# Altium schematic sheet 02-Power.SchDoc: ECE315 Analog
size A; Date: 4/25/2017; ApprovedBy: JSK; CheckedBy: JSK; Author: JSK; CompanyName: University of Wisconsin; DrawnBy: JSK; Engineer: JSK; Organization: ECE 315; Address1: College of Engineering; Address2: 1415 Engineering Drive; Address3: Madison, WI 53706; Address4: ECE 315 Fall 2017; Revision: A; SheetNumber: 2; SheetTotal: 2; AssemblyNumber: 0; MachineName: ECE315-S19; PCBNumber: 001; ApprovedDate: 1/17/2019
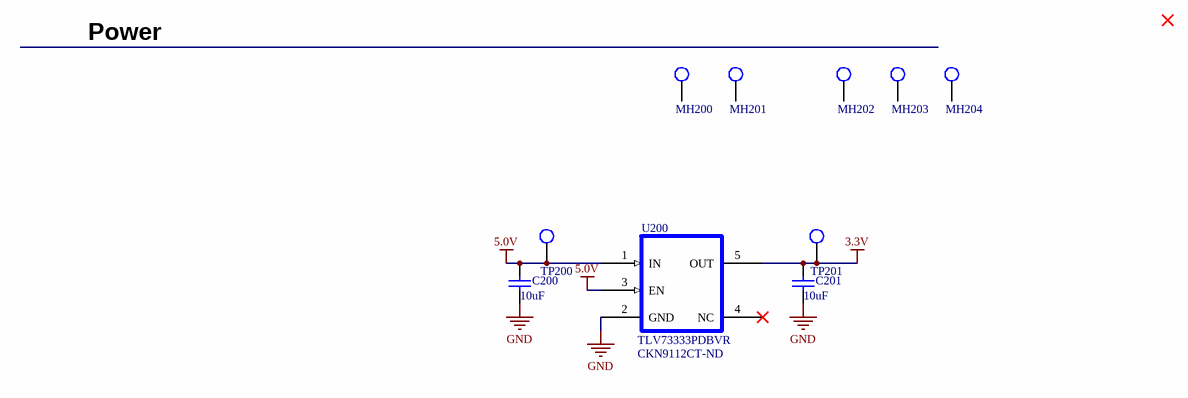
[diagram p0: 02-Power.SchDoc]

## Parts
C200  10uF  [CAP_0805]
C201  10uF  [CAP_0805]
MH200  MHOLE_2_55MM  [MHOLE_2_55MM]  (value not drawn)
MH201  MHOLE_2_55MM  [MHOLE_2_55MM]  (value not drawn)
MH202  MHOLE_2_55MM  [MHOLE_2_55MM]  (value not drawn)
MH203  MHOLE_2_55MM  [MHOLE_2_55MM]  (value not drawn)
MH204  MHOLE_2_55MM  [MHOLE_2_55MM]  (value not drawn)
TP200  TP_1206  [TP-SMC-1206]  (value not drawn)
TP201  TP_1206  [TP-SMC-1206]  (value not drawn)
U200  TLV73333PDBVR  Supplier Part Number 1: CKN9112CT-ND  [IC_TLV73333PDBVR]

## Nets
3.3V: C201.1 TP201.1 U200.5(OUT)
5.0V: C200.1 TP200.1 U200.1(IN) U200.3(EN)
GND: C200.2 C201.2 U200.2(GND)

Not connected (* = marked no-connect by the designer): MH200 1; MH201 1; MH202 1; MH203 1; MH204 1; U200 4(NC)*

## Notes on the sheet
- Power
- Title:
- Size:
- A
- Machine:
- P.C. Board No:
- Assembly No:
- Rev:
- Sheet:
- of
- College of Engineering
- 1415 Engineering Drive
- Madison, WI 53706

## Library data of the parts
C200 C201 = CAP_0805_U_010.00: CAP CER 10UF 16V X5R 0805; Manufacturer: Samsung; Manufacturer Part Number: CL21A106KOFNNNE; Tolerance: 10%; ComponentLink3URL: https://datasheet.ciiva.com/26920/getdatasheetpartid-355170-26920201.pdf; ComponentLink3Description: https://datasheet.ciiva.com/26920/getdatasheetpartid-355170-26920201.pdf; ComponentLink1URL: https://datasheet.ciiva.com/25730/cl21a106kpclqnc-25730594.pdf; ComponentLink1Description: https://datasheet.ciiva.com/25730/cl21a106kpclqnc-25730594.pdf; Mount: Surface Mount; Case/Package: 0805; Case Code (Metric): 2012; Case Code (Imperial): 0805; Min Operating Temperature: -55°C; Max Operating Temperature: 85°C; Packaging: Tape and Reel; Capacitance: 10uF; Voltage Rating: 16V; Package Quantity: 2000; Dielectric: X5R; Length: 2mm; Height: 1.25mm; Width: 0.049inch; Thickness: 0.053inch; Depth: 1.25mm; Radiation Hardening: No; ComponentLink2URL: http://www.samsungsem.com/kr/support/product-search/mlcc/CL21A106KOFNNNE.jsp; ComponentLink2Description: http://www.samsungsem.com/kr/support/product-search/mlcc/CL21A106KOFNNNE.jsp; ComponentLink4URL: http://www1.futureelectronics.com/doc/SAMSUNG/CL21A106KOFNNNE.pdf; ComponentLink4Description: http://www1.futureelectronics.com/doc/SAMSUNG/CL21A106KOFNNNE.pdf; ComponentLink5URL: https://www.verical.com/server-webapp/html/getDatasheet?partID=354009; ComponentLink5Description: https://www.verical.com/server-webapp/html/getDatasheet?partID=354009; Supplier 1: Digi-Key; Stock 1: 1158169; Pricing 1: 1=0.29, 10=0.199, 100=0.1009, 500=0.06904, 1000=0.06107 (USD)
MH200-MH204 = MHOLE_2_55MM: Mounting Holde; Manufacturer Part Number: UW MTHOLE
TP200 TP201 = TP_1206: Test Point SMD 1206; Manufacturer: TE Connectivity (Tyco Electronics); Manufacturer Part Number: 1625854-1; Resistance Value: 0 Ohm; Temperature Coefficient: N/R; Supplier 1: Digi-Key; Supplier Part Number 1: A106143CT-ND; Stock 1: 31937; Pricing 1: 1=0.28, 10=0.261, 25=0.224, 50=0.1902, 100=0.1828, 250=0.1641, 500=0.1567, 1000=0.1306 (USD); Case Size: 1206; Dimension: 3.2 x 1.6 x 1.25mm; Family: RC; Mounting: Surface Mount; Operating Temperature: -55 to 125 C; Part No: 1625854-1; RoHS: Yes; Packaging: Tape and Reel; Termination Style: N/R; Terminal Pitch: N/R; Power Rating: N/R; Tolerance: N/R; ComponentLink1URL: https://datasheet.ciiva.com/6439/eng-ds-1773266-a-6439169.pdf; ComponentLink1Description: https://datasheet.ciiva.com/6439/eng-ds-1773266-a-6439169.pdf; ComponentLink2URL: https://datasheet.ciiva.com/30136/1773266-a-30136341.pdf; ComponentLink2Description: https://datasheet.ciiva.com/30136/1773266-a-30136341.pdf; ComponentLink3URL: https://datasheet.ciiva.com/6439/eng-ds-1773266-a-6439080.pdf; ComponentLink3Description: https://datasheet.ciiva.com/6439/eng-ds-1773266-a-6439080.pdf; ComponentLink4URL: https://datasheet.ciiva.com/6439/eng-ds-1773266-a-6439081.pdf; ComponentLink4Description: https://datasheet.ciiva.com/6439/eng-ds-1773266-a-6439081.pdf; ComponentLink5URL: https://datasheet.ciiva.com/6439/eng-ds-1773266-a-6439083.pdf; ComponentLink5Description: https://datasheet.ciiva.com/6439/eng-ds-1773266-a-6439083.pdf
U200 = TLV73333PDBVR: Manufacturer: Texas Instruments; Number of Outputs: 1; Min Input Voltage: 1.4V; Max Input Voltage: 5.5V; Max Output Current: 300mA; Output Voltage: 3.3V; Dropout Voltage: 125mV; Min Current Limit: 360mA; Polarity: Positive; Quiescent Current: 60uA; Accuracy: 1%; Output Type: Fixed; Mechanical Life: 100000Cycles; Actuator Material: Nylon,Polyamide; Throw Configuration: SPST; Operating Force: 160gf; Illumination Type: Illuminated,Non-Illuminated; Switch Function: Off-Mom; Voltage Rating (DC): 12V; Actuator Type: Standard; Current Rating: 50mA; Contact Resistance: 100mR; Actuator Length: 0.85mm; Manufacturer Part Number: TLV73333PDBVR; Mount: Surface Mount; Case/Package: SOT-23-5; Number of Pins: 5; Weight: 0.000557oz; Contact Plating: Gold; Min Operating Temperature: -40°C; Max Operating Temperature: 125°C; Packaging: Tape and Reel; Output Current: 300mA; Number of Regulators: 1; Package Quantity: 3000; Radiation Hardening: No; Lead Free: Lead Free; ComponentLink1URL: http://www.ti.com/general/docs/lit/getliterature.tsp?genericPartNumber=TLV733P&&fileType=pdf; ComponentLink1Description: http://www.ti.com/general/docs/lit/getliterature.tsp?genericPartNumber=TLV733P&&fileType=pdf; Supplier 1: Digi-Key; Stock 1: 783192; Pricing 1: 1=0.16, 10=0.157, 25=0.1516, 50=0.1462, 100=0.1381, 250=0.12996, 500=0.12452 (USD); Contact Material: Silver; Color: Black; Termination: Gull Wing; Max Voltage Rating (DC): 12V; Orientation: Straight; Max Current Rating: 50mA; Length: 6mm; Depth: 9mm; REACH SVHC: No SVHC; ComponentLink2URL: https://www.verical.com/server-webapp/html/getDatasheet?partID=786341; ComponentLink2Description: https://www.verical.com/server-webapp/html/getDatasheet?partID=786341; ComponentLink3URL: https://www.ckswitches.com/media/1471/pts645.pdf; ComponentLink3Description: https://www.ckswitches.com/media/1471/pts645.pdf; ComponentLink4URL: https://www.verical.com/server-webapp/html/getDatasheet?partID=764615; ComponentLink4Description: https://www.verical.com/server-webapp/html/getDatasheet?partID=764615